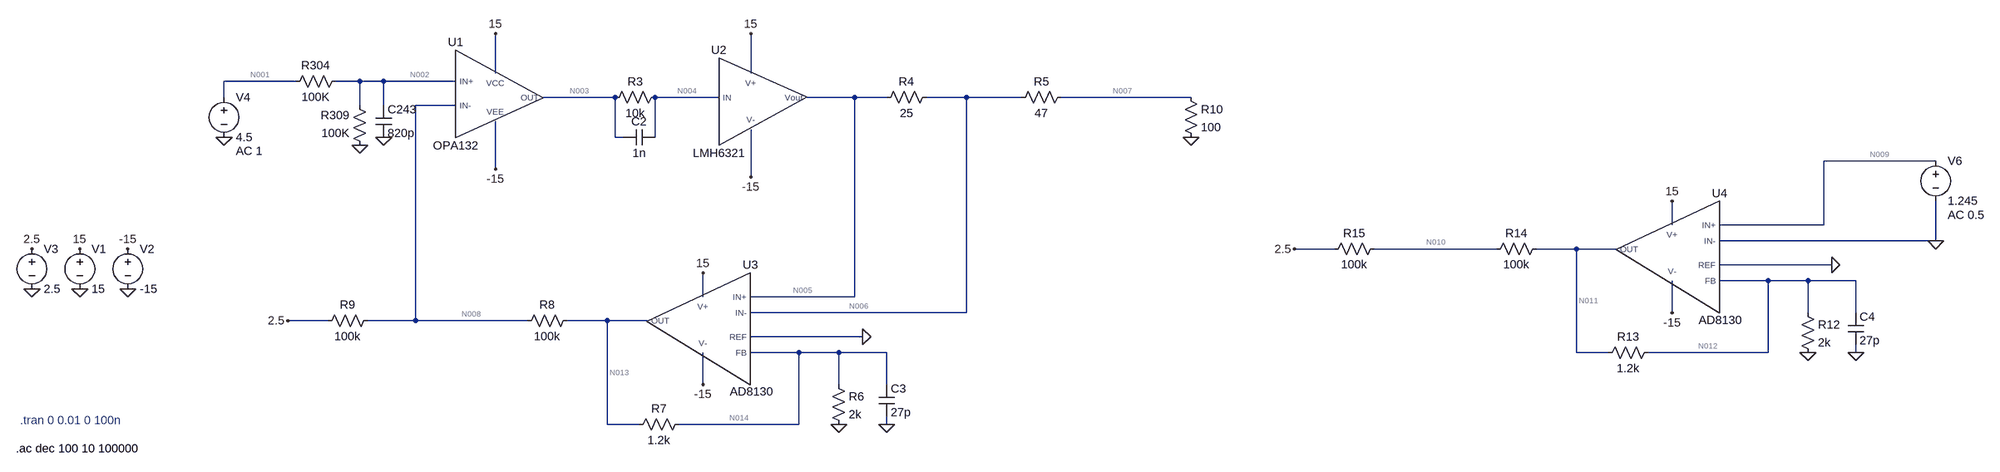
[diagram p0: schematic current_driver_CLoop.asc]
current_driver_CLoop.asc, the LTspice schematic file:
Version 4
SHEET 1 4676 1552
WIRE 592 128 592 48
WIRE 1104 128 1104 48
WIRE 192 144 48 144
WIRE 320 144 272 144
WIRE 368 144 320 144
WIRE 512 144 368 144
WIRE 48 176 48 144
WIRE 832 176 688 176
WIRE 1040 176 912 176
WIRE 1312 176 1216 176
WIRE 1376 176 1312 176
WIRE 1536 176 1456 176
WIRE 1648 176 1536 176
WIRE 2176 176 1728 176
WIRE 320 192 320 144
WIRE 368 192 368 144
WIRE 512 192 432 192
WIRE 832 256 832 176
WIRE 848 256 832 256
WIRE 912 256 912 176
WIRE 4560 304 4336 304
WIRE 592 320 592 224
WIRE 1104 336 1104 240
WIRE 4032 432 4032 384
WIRE 4336 432 4336 304
WIRE 4336 432 4128 432
WIRE 4560 464 4560 384
WIRE 4560 464 4128 464
WIRE 3280 480 3200 480
WIRE 3680 480 3360 480
WIRE 3840 480 3760 480
WIRE 3920 480 3840 480
WIRE 4352 512 4128 512
WIRE 4224 544 4128 544
WIRE 4304 544 4224 544
WIRE 4400 544 4304 544
WIRE 1008 576 1008 528
WIRE 1312 576 1312 176
WIRE 1312 576 1104 576
WIRE 1536 608 1536 176
WIRE 1536 608 1104 608
WIRE 4032 608 4032 544
WIRE 4304 608 4304 544
WIRE 4400 608 4400 544
WIRE 256 624 176 624
WIRE 432 624 432 192
WIRE 432 624 336 624
WIRE 656 624 432 624
WIRE 816 624 736 624
WIRE 896 624 816 624
WIRE 1328 656 1104 656
WIRE 1200 688 1104 688
WIRE 1280 688 1200 688
WIRE 1376 688 1280 688
WIRE 3840 688 3840 480
WIRE 3904 688 3840 688
WIRE 4224 688 4224 544
WIRE 4224 688 3984 688
WIRE 4400 688 4400 672
WIRE 1008 752 1008 688
WIRE 1280 752 1280 688
WIRE 1376 752 1376 688
WIRE 816 832 816 624
WIRE 880 832 816 832
WIRE 1200 832 1200 688
WIRE 1200 832 960 832
WIRE 1376 832 1376 816
FLAG 320 272 0
FLAG 368 256 0
FLAG -256 560 0
FLAG -160 560 0
FLAG -256 480 15
FLAG -160 480 -15
FLAG 592 48 15
FLAG 592 320 -15
FLAG 1104 48 15
FLAG 1104 336 -15
FLAG 1328 656 0
FLAG 1280 832 0
FLAG 1376 832 0
FLAG -352 560 0
FLAG -352 480 2.5
FLAG 176 624 2.5
FLAG 2176 256 0
FLAG 48 256 0
FLAG 1008 528 15
FLAG 1008 752 -15
FLAG 4352 512 0
FLAG 4304 688 0
FLAG 4400 688 0
FLAG 3200 480 2.5
FLAG 4032 384 15
FLAG 4032 608 -15
FLAG 4560 464 0
SYMBOL res 288 128 R90
WINDOW 0 0 56 VBottom 2
WINDOW 3 32 56 VTop 2
SYMATTR InstName R304
SYMATTR Value 100K
SYMBOL res 336 288 R180
WINDOW 0 36 76 Left 2
WINDOW 3 36 40 Left 2
SYMATTR InstName R309
SYMATTR Value 100K
SYMBOL cap 352 192 R0
SYMATTR InstName C243
SYMATTR Value 820p
SYMBOL voltage -256 464 R0
WINDOW 123 0 0 Left 2
WINDOW 39 0 0 Left 2
SYMATTR InstName V1
SYMATTR Value 15
SYMBOL voltage -160 464 R0
WINDOW 123 0 0 Left 2
WINDOW 39 0 0 Left 2
SYMATTR InstName V2
SYMATTR Value -15
SYMBOL res 928 160 R90
WINDOW 0 0 56 VBottom 2
WINDOW 3 32 56 VTop 2
SYMATTR InstName R3
SYMATTR Value 10k
SYMBOL cap 912 240 R90
WINDOW 0 0 32 VBottom 2
WINDOW 3 32 32 VTop 2
SYMATTR InstName C2
SYMATTR Value 1n
SYMBOL AutoGenerated\\OPA132 592 160 R0
SYMATTR InstName U1
SYMBOL AutoGenerated\\LMH6321 1104 176 R0
SYMATTR InstName U2
SYMBOL res 1472 160 R90
WINDOW 0 0 56 VBottom 2
WINDOW 3 32 56 VTop 2
SYMATTR InstName R4
SYMATTR Value 25
SYMBOL res 1744 160 R90
WINDOW 0 0 56 VBottom 2
WINDOW 3 32 56 VTop 2
SYMATTR InstName R5
SYMATTR Value 47
SYMBOL AutoGenerated\\AD8130 1072 640 M0
SYMATTR InstName U3
SYMBOL res 1264 736 R0
SYMATTR InstName R6
SYMATTR Value 2k
SYMBOL cap 1360 752 R0
SYMATTR InstName C3
SYMATTR Value 27p
SYMBOL res 976 816 R90
WINDOW 0 0 56 VBottom 2
WINDOW 3 32 56 VTop 2
SYMATTR InstName R7
SYMATTR Value 1.2k
SYMBOL res 752 608 R90
WINDOW 0 0 56 VBottom 2
WINDOW 3 32 56 VTop 2
SYMATTR InstName R8
SYMATTR Value 100k
SYMBOL res 352 608 R90
WINDOW 0 0 56 VBottom 2
WINDOW 3 32 56 VTop 2
SYMATTR InstName R9
SYMATTR Value 100k
SYMBOL voltage -352 464 R0
WINDOW 123 0 0 Left 2
WINDOW 39 0 0 Left 2
SYMATTR InstName V3
SYMATTR Value 2.5
SYMBOL res 2160 160 R0
SYMATTR InstName R10
SYMATTR Value 100
SYMBOL voltage 48 160 R0
WINDOW 123 24 124 Left 2
WINDOW 39 0 0 Left 2
SYMATTR Value2 AC 1
SYMATTR InstName V4
SYMATTR Value 4.5
SYMBOL AutoGenerated\\AD8130 4096 496 M0
SYMATTR InstName U4
SYMBOL res 4288 592 R0
SYMATTR InstName R12
SYMATTR Value 2k
SYMBOL cap 4384 608 R0
SYMATTR InstName C4
SYMATTR Value 27p
SYMBOL res 4000 672 R90
WINDOW 0 0 56 VBottom 2
WINDOW 3 32 56 VTop 2
SYMATTR InstName R13
SYMATTR Value 1.2k
SYMBOL res 3776 464 R90
WINDOW 0 0 56 VBottom 2
WINDOW 3 32 56 VTop 2
SYMATTR InstName R14
SYMATTR Value 100k
SYMBOL res 3376 464 R90
WINDOW 0 0 56 VBottom 2
WINDOW 3 32 56 VTop 2
SYMATTR InstName R15
SYMATTR Value 100k
SYMBOL voltage 4560 288 R0
WINDOW 123 24 124 Left 2
WINDOW 39 0 0 Left 2
SYMATTR Value2 AC 0.5
SYMATTR InstName V6
SYMATTR Value 1.245
TEXT -384 880 Left 2 !.ac dec 100 10 100000
TEXT -376 824 Left 2 ;.tran 0 0.01 0 100n

The netlist it stands for:
* current_driver_CLoop.asc
R304 N002 N001 100K
R309 0 N002 100K
C243 N002 0 820p
V1 15 0 15
V2 -15 0 -15
R3 N004 N003 10k
C2 N004 N003 1n
XU1 N002 N008 15 -15 N003 OPA132  ; pins IN+ IN- VCC VEE OUT
XU2 N004 15 -15 N005 LMH6321  ; pins IN V+ V- Vout
R4 N006 N005 25
R5 N007 N006 47
XU3 N005 N006 0 N014 15 -15 N013 AD8130  ; pins IN+ IN- REF FB V+ V- OUT
R6 N014 0 2k
C3 N014 0 27p
R7 N014 N013 1.2k
R8 N013 N008 100k
R9 N008 2.5 100k
V3 2.5 0 2.5
R10 N007 0 100
V4 N001 0 4.5 AC 1
XU4 N009 0 0 N012 15 -15 N011 AD8130  ; pins IN+ IN- REF FB V+ V- OUT
R12 N012 0 2k
C4 N012 0 27p
R13 N012 N011 1.2k
R14 N011 N010 100k
R15 N010 2.5 100k
V6 N009 0 1.245 AC 0.5
.ac dec 100 10 100000
* .tran 0 0.01 0 100n
.lib C:\Users\Jorge\Desktop\OPA132.LIB
.lib C:\Users\Jorge\Desktop\LMH6321.MOD
.lib C:\Users\Jorge\Desktop\ad8130.cir
.backanno
.end

* Results of the author's LTspice run, read from the files saved beside the schematic
* Operating Point, zero values left out:
*   V(n002) = 2.25 V
*   V(n001) = 4.5 V
*   V(15) = 15 V
*   V(-15) = -15 V
*   V(n004) = 8.808 V
*   V(n003) = 8.867 V
*   V(n008) = 2.25 V
*   V(n005) = 8.57 V
*   V(n006) = 7.324 V
*   V(n007) = 4.982 V
*   V(n014) = 1.249 V
*   V(n013) = 2.001 V
*   V(2.5) = 2.5 V
*   V(n009) = 1.245 V
*   V(n012) = 1.248 V
*   V(n011) = 2 V
*   V(n010) = 2.25 V
*   I(R15) = -2.501 µA
*   I(R14) = -2.501 µA
*   I(R13) = -626.2 µA
*   I(R12) = 624.1 µA
*   I(R10) = 49.82 mA
*   I(R9) = -2.497 µA
*   I(R8) = -2.497 µA
*   I(R7) = -626.5 µA
*   I(R6) = 624.4 µA
*   I(R5) = -49.82 mA
*   I(R4) = -49.82 mA
*   I(R3) = -5.879 µA
*   I(R309) = -22.5 µA
*   I(R304) = -22.5 µA
*   I(V6) = -1.063 µA
*   I(V4) = -22.5 µA
*   I(V3) = -4.999 µA
*   I(V2) = 36.8 mA
*   I(V1) = -87.87 mA
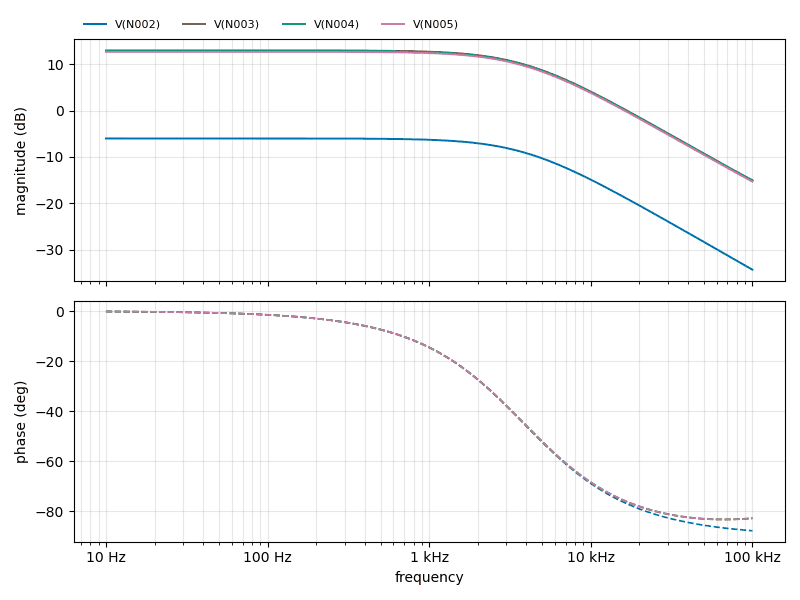
[diagram p1: AC Analysis of current_driver_CLoop.asc, plotted from the saved traces]
* AC Analysis, 1 run:
*   V(N002): -6.02 dB at 10 Hz, -34.31 dB at 100 kHz, peak -6.02 dB at 10 Hz, 3 dB below the peak at 3.853 kHz
*   V(N003): 12.96 dB at 10 Hz, -15.06 dB at 100 kHz, peak 12.96 dB at 10 Hz, 3 dB below the peak at 3.852 kHz
*   V(N004): 12.89 dB at 10 Hz, -15.09 dB at 100 kHz, peak 12.89 dB at 10 Hz, 3 dB below the peak at 3.854 kHz
*   V(N005): 12.66 dB at 10 Hz, -15.32 dB at 100 kHz, peak 12.66 dB at 10 Hz, 3 dB below the peak at 3.854 kHz